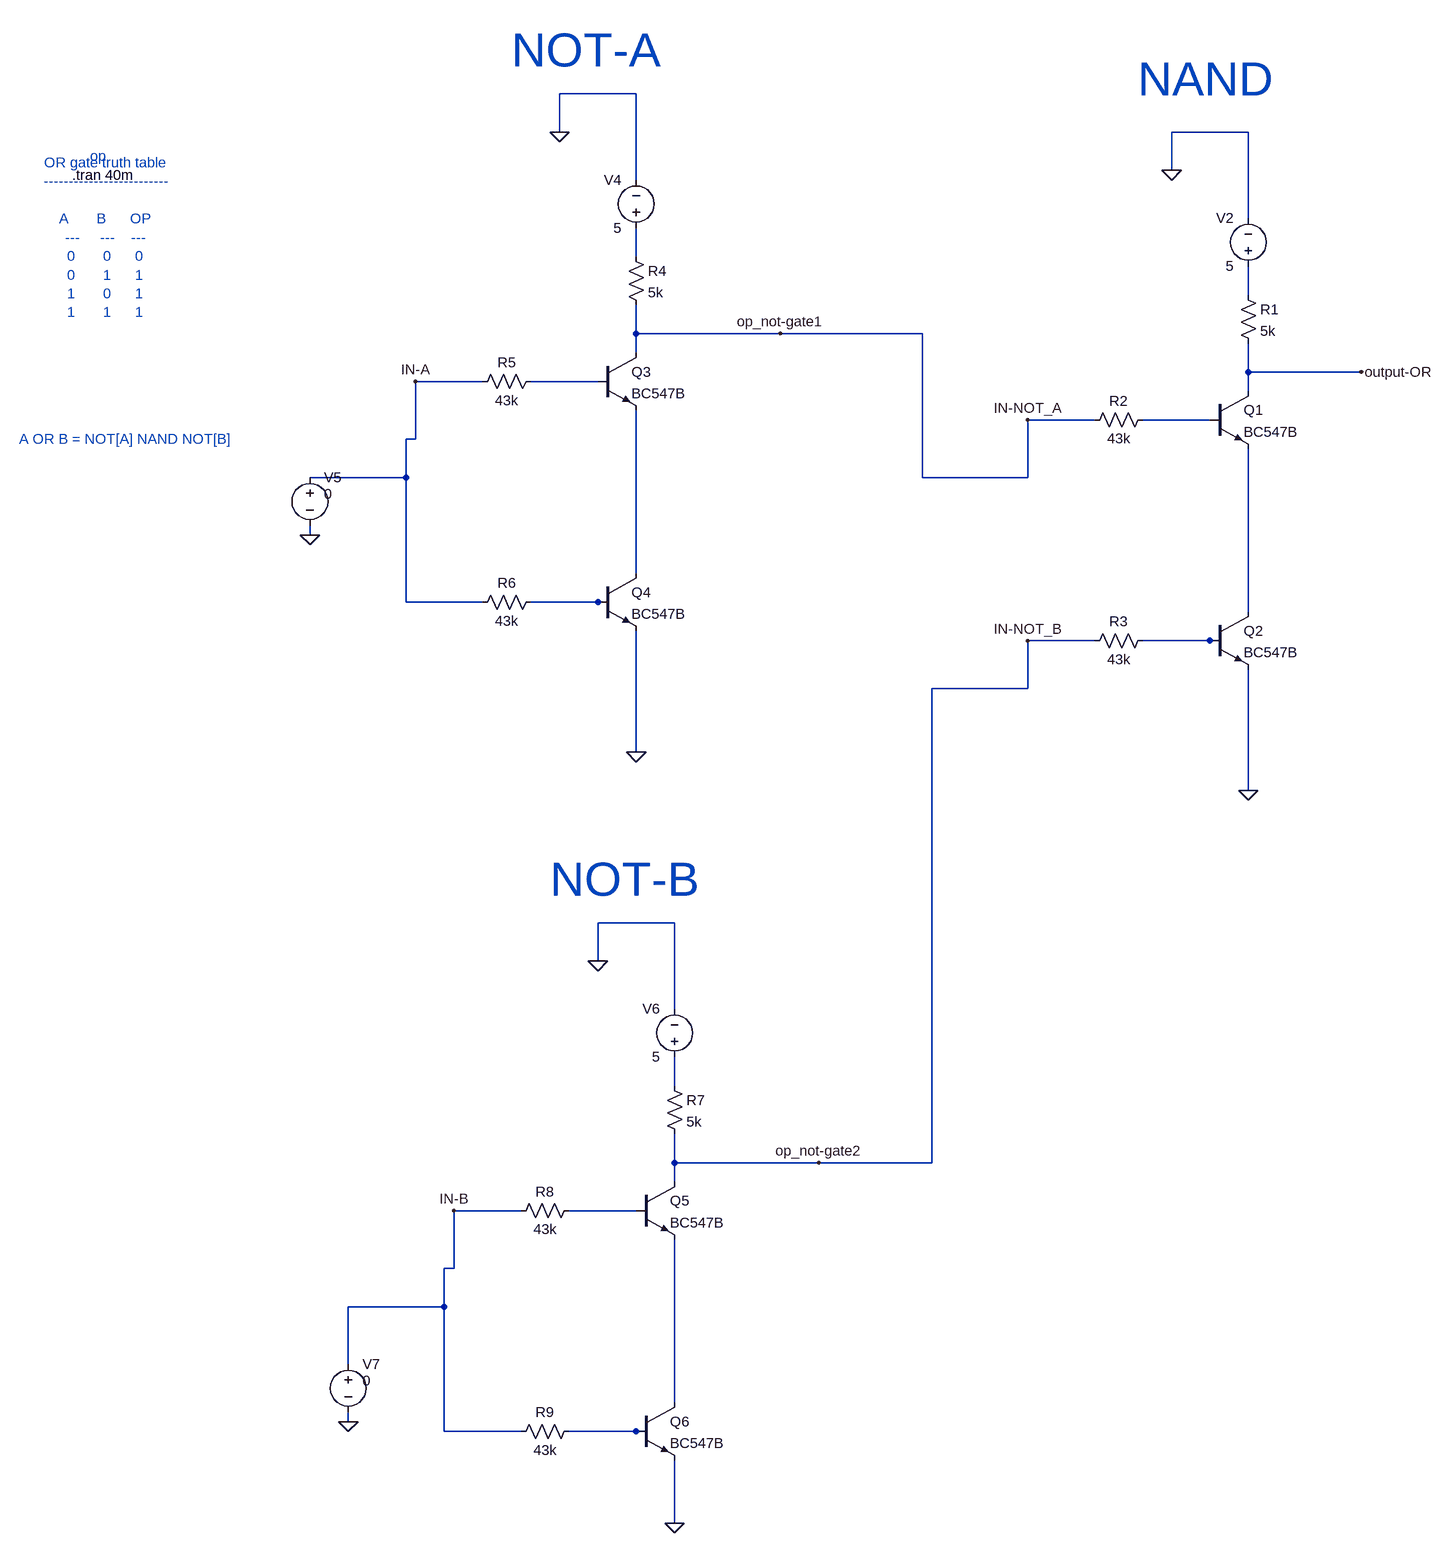
[diagram p0: schematic OR_gate_using_NAND_gate.asc]
OR_gate_using_NAND_gate.asc, the LTspice schematic file:
Version 4.1
SHEET 1 3052 2404
WIRE 512 -448 384 -448
WIRE 384 -384 384 -448
WIRE 2576 -384 2448 -384
WIRE 2448 -320 2448 -384
WIRE 512 -304 512 -448
WIRE 2576 -240 2576 -384
WIRE 512 -176 512 -224
WIRE 2576 -112 2576 -160
WIRE 512 -48 512 -96
WIRE 752 -48 512 -48
WIRE 1696 -48 752 -48
WIRE 512 -16 512 -48
WIRE 2576 16 2576 -32
WIRE 2816 16 2576 16
WIRE 256 32 144 32
WIRE 448 32 336 32
WIRE 2576 48 2576 16
WIRE 2320 96 2208 96
WIRE 2512 96 2400 96
WIRE 144 128 144 32
WIRE 144 128 128 128
WIRE 128 192 128 128
WIRE 128 192 -32 192
WIRE 1696 192 1696 -48
WIRE 2208 192 2208 96
WIRE 2208 192 1696 192
WIRE -32 288 -32 272
WIRE 512 352 512 80
WIRE 128 400 128 192
WIRE 256 400 128 400
WIRE 448 400 336 400
WIRE 464 400 448 400
WIRE 2576 416 2576 144
WIRE 2320 464 2208 464
WIRE 2512 464 2400 464
WIRE 2528 464 2512 464
WIRE 2208 544 2208 464
WIRE 2208 544 1712 544
WIRE 512 800 512 448
WIRE 2576 864 2576 512
WIRE 576 1136 448 1136
WIRE 448 1200 448 1136
WIRE 576 1280 576 1136
WIRE 576 1408 576 1360
WIRE 576 1536 576 1488
WIRE 816 1536 576 1536
WIRE 1712 1536 1712 544
WIRE 1712 1536 816 1536
WIRE 576 1568 576 1536
WIRE 320 1616 208 1616
WIRE 512 1616 400 1616
WIRE 208 1712 208 1616
WIRE 208 1712 192 1712
WIRE 192 1776 192 1712
WIRE 192 1776 32 1776
WIRE 32 1872 32 1776
WIRE 576 1936 576 1664
WIRE 32 1968 32 1952
WIRE 192 1984 192 1776
WIRE 320 1984 192 1984
WIRE 512 1984 400 1984
WIRE 528 1984 512 1984
WIRE 576 2384 576 2032
FLAG 2208 96 IN-NOT_A
FLAG 2448 -320 0
FLAG 2816 16 output-OR
FLAG 2576 864 0
FLAG 2208 464 IN-NOT_B
FLAG 144 32 IN-A
FLAG 384 -384 0
FLAG 752 -48 op_not-gate1
FLAG 512 800 0
FLAG -32 288 0
FLAG 208 1616 IN-B
FLAG 448 1200 0
FLAG 816 1536 op_not-gate2
FLAG 576 2384 0
FLAG 32 1968 0
SYMBOL npn 2512 48 R0
SYMATTR InstName Q1
SYMATTR Value BC547B
SYMBOL voltage 2576 -144 R180
WINDOW 0 24 96 Left 2
WINDOW 3 24 16 Left 2
WINDOW 123 0 0 Left 0
WINDOW 39 0 0 Left 0
SYMATTR InstName V2
SYMATTR Value 5
SYMBOL res 2560 -128 R0
SYMATTR InstName R1
SYMATTR Value 5k
SYMBOL res 2416 80 R90
WINDOW 0 0 56 VBottom 2
WINDOW 3 32 56 VTop 2
SYMATTR InstName R2
SYMATTR Value 43k
SYMBOL npn 2512 416 R0
SYMATTR InstName Q2
SYMATTR Value BC547B
SYMBOL res 2416 448 R90
WINDOW 0 0 56 VBottom 2
WINDOW 3 32 56 VTop 2
SYMATTR InstName R3
SYMATTR Value 43k
SYMBOL npn 448 -16 R0
SYMATTR InstName Q3
SYMATTR Value BC547B
SYMBOL voltage 512 -208 R180
WINDOW 0 24 96 Left 2
WINDOW 3 24 16 Left 2
WINDOW 123 0 0 Left 0
WINDOW 39 0 0 Left 0
SYMATTR InstName V4
SYMATTR Value 5
SYMBOL res 496 -192 R0
SYMATTR InstName R4
SYMATTR Value 5k
SYMBOL res 352 16 R90
WINDOW 0 0 56 VBottom 2
WINDOW 3 32 56 VTop 2
SYMATTR InstName R5
SYMATTR Value 43k
SYMBOL npn 448 352 R0
SYMATTR InstName Q4
SYMATTR Value BC547B
SYMBOL res 352 384 R90
WINDOW 0 0 56 VBottom 2
WINDOW 3 32 56 VTop 2
SYMATTR InstName R6
SYMATTR Value 43k
SYMBOL voltage -32 176 R0
WINDOW 3 24 44 Left 2
WINDOW 123 0 0 Left 0
WINDOW 39 0 0 Left 0
SYMATTR Value 0
SYMATTR InstName V5
SYMBOL npn 512 1568 R0
SYMATTR InstName Q5
SYMATTR Value BC547B
SYMBOL voltage 576 1376 R180
WINDOW 0 24 96 Left 2
WINDOW 3 24 16 Left 2
WINDOW 123 0 0 Left 0
WINDOW 39 0 0 Left 0
SYMATTR InstName V6
SYMATTR Value 5
SYMBOL res 560 1392 R0
SYMATTR InstName R7
SYMATTR Value 5k
SYMBOL res 416 1600 R90
WINDOW 0 0 56 VBottom 2
WINDOW 3 32 56 VTop 2
SYMATTR InstName R8
SYMATTR Value 43k
SYMBOL npn 512 1936 R0
SYMATTR InstName Q6
SYMATTR Value BC547B
SYMBOL res 416 1968 R90
WINDOW 0 0 56 VBottom 2
WINDOW 3 32 56 VTop 2
SYMATTR InstName R9
SYMATTR Value 43k
SYMBOL voltage 32 1856 R0
WINDOW 3 24 44 Left 2
WINDOW 123 0 0 Left 0
WINDOW 39 0 0 Left 0
SYMATTR Value 0
SYMATTR InstName V7
TEXT -712 -312 Left 2 !.tran 40m
TEXT -688 -344 Left 2 ;.op
TEXT -656 -208 Center 2 ;OR gate truth table\n-------------------------\n \nA       B      OP\n---     ---    ---\n0       0      0\n0       1      1\n1       0      1\n1       1      1
TEXT -800 128 Left 2 ;A OR B = NOT[A] NAND NOT[B]
TEXT 2392 -472 Left 6 ;NAND
TEXT 304 -520 Left 6 ;NOT-A
TEXT 368 1064 Left 6 ;NOT-B

The netlist it stands for:
* OR_gate_using_NAND_gate.asc
Q1 output-OR N004 N007 0 BC547B
V2 N002 0 5
R1 N002 output-OR 5k
R2 N004 op_not-gate1 43k
Q2 N007 N008 0 0 BC547B
R3 N008 op_not-gate2 43k
Q3 op_not-gate1 N003 N005 0 BC547B
V4 N001 0 5
R4 N001 op_not-gate1 5k
R5 N003 IN-A 43k
Q4 N005 N006 0 0 BC547B
R6 N006 IN-A 43k
V5 IN-A 0 0
Q5 op_not-gate2 N010 N011 0 BC547B
V6 N009 0 5
R7 N009 op_not-gate2 5k
R8 N010 IN-B 43k
Q6 N011 N012 0 0 BC547B
R9 N012 IN-B 43k
V7 IN-B 0 0
.model NPN NPN
.model PNP PNP
.lib standard.bjt
.tran 40m
* .op
* OR gate truth table
* -------------------------
* A       B      OP
* ---     ---    ---
* 0       0      0
* 0       1      1
* 1       0      1
* 1       1      1
* A OR B = NOT[A] NAND NOT[B]
* NAND
* NOT-A
* NOT-B
.backanno
.end